# Altium schematic sheet Mainboard_V1.0_MCU.SchDoc: Mainboard
size A4; PageSetup: Record=PageOptions|CenterHorizontal=True|CenterVertical=True|PrintScale=0.97|XCorrection=1.00|YCorrection=1.00|PrintKind=0|BorderSize=5000000|LeftOffset=0|BottomOffset=0|Orientation=2|PaperLength=1000|PaperWidth=1000|Scale=100|PaperSource=7|PrintQuality=-3|MediaType=1|DitherType=10|PrintScaleMode=1|PaperKind=A4|PaperIndex=9; Organization: Ostschweizer Fachhochschule; Address2: Florian Baumgartner & Thierry Schwaller; Address3: florian.baumgartner@ost.ch; DocumentNumber: 2; Revision: V1.0; SheetNumber: 2; SheetTotal: 7; Author: Florian Baumgartner & Alain Keller; Subtitle: MCU
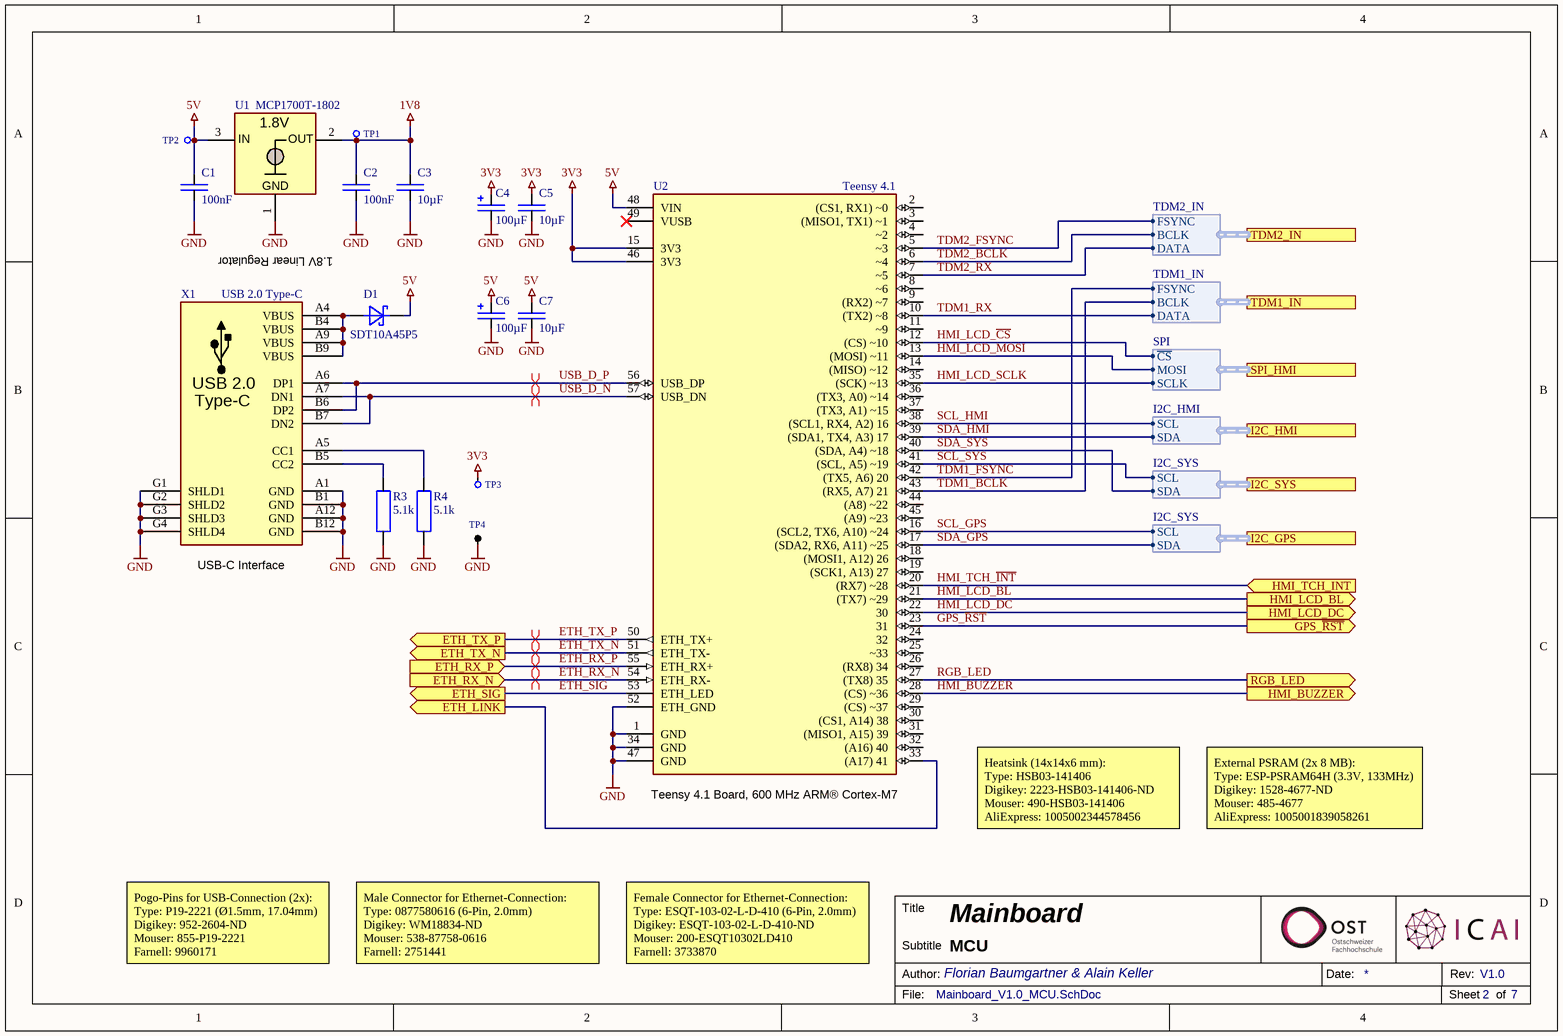
[diagram p0: Mainboard_V1.0_MCU.SchDoc]

## Parts
C1  100nF  [SMD Keramikkondensator 0603]
C2  100nF  [SMD Keramikkondensator 0603]
C3  10µF  [SMD Keramikkondensator 1206]
C4  100µF  [SMD Tantalkondensator 1210 +]
C5  10µF  [SMD Keramikkondensator 1206]
C6  100µF  [SMD Tantalkondensator 1210 +]
C7  10µF  [SMD Keramikkondensator 1206]
D1  SDT10A45P5  [SMD Diode PowerDI-5]
R3  5.1k  [SMD Widerstand 0603]
R4  5.1k  [SMD Widerstand 0603]
TP1  X-TP  [THT Testpunkt Ø1mm]  (value not drawn)  (no BOM)
TP2  X-TP  [THT Testpunkt Ø1mm]  (value not drawn)  (no BOM)
TP3  X-TP  [THT Testpunkt Ø1mm]  (value not drawn)  (no BOM)
TP4  Schwarz  [THT Messpunkt Ø2.54mm Schwarz]  (value not drawn)
U1  MCP1700T-1802  [SMD IC SOT-23-3]
U2  Teensy 4.1  [THT Teensy 4.1]
X1  USB 2.0 Type-C  [THT USB-C Socket (KH-TYPE-C-L10-14P)]

## Ports
ETH_LINK (out), ETH_RX_N (in), ETH_RX_P (in), ETH_SIG (out), ETH_TX_N (out), ETH_TX_P (out), GPS_~{RST} (out), HMI_BUZZER (out), HMI_LCD_BL (out), HMI_LCD_DC (out), HMI_TCH_INT (in), I2C_GPS (harness I2C_SYS), I2C_HMI (harness I2C_HMI), I2C_SYS (harness I2C_SYS), RGB_LED (out), SPI_HMI (harness SPI), TDM1_IN (harness TDM1_IN), TDM2_IN (harness TDM2_IN)

## Harnesses
I2C_HMI: SCL, SDA
TDM1_IN: BCLK, FSYNC, DATA
I2C_SYS: SCL, SDA
TDM2_IN: BCLK, FSYNC, DATA
SPI: SCLK, MOSI, ~{CS}

## Nets
1V8: C2.2 C3.2 TP1.1 U1.2(OUT)
3V3: C4.P(+) C5.2 TP3.1 U2.15(3V3) U2.46(3V3)
5V: C1.2 C6.P(+) C7.2 D1.K TP2.1 U1.3(IN) U2.48(VIN)
GND: C1.1 C2.1 C3.1 C4.M(-) C5.1 C6.M(-) C7.1 R3.2 R4.2 TP4.1 U1.1(GND) U2.1(GND) U2.34(GND) U2.47(GND) U2.52(ETH_GND) X1.A1(GND) X1.A12(GND) X1.B1(GND) X1.B12(GND) X1.G1(SHLD1) X1.G2(SHLD2) X1.G3(SHLD3) X1.G4(SHLD4)
ETH_LINK: U2.33((A17)_41) ; port ETH_LINK
ETH_RX_N: U2.54(ETH_RX-) ; port ETH_RX_N
ETH_RX_P: U2.55(ETH_RX+) ; port ETH_RX_P
ETH_SIG: U2.53(ETH_LED) ; port ETH_SIG
ETH_TX_N: U2.51(ETH_TX-) ; port ETH_TX_N
ETH_TX_P: U2.50(ETH_TX+) ; port ETH_TX_P
GPS_~{RST}: U2.23(31) ; port GPS_~{RST}
HMI_BUZZER: U2.28((CS)_~36) ; port HMI_BUZZER
HMI_LCD_BL: U2.21((TX7)_~29) ; port HMI_LCD_BL
HMI_LCD_~{CS}: U2.12((CS)_~10) ; port SPI_HMI.~{CS}
HMI_LCD_DC: U2.22(30) ; port HMI_LCD_DC
HMI_LCD_MOSI: U2.13((MOSI)_~11) ; port SPI_HMI.MOSI
HMI_LCD_SCLK: U2.35((SCK)_~13) ; port SPI_HMI.SCLK
HMI_TCH_~{INT}: U2.20((RX7)_~28) ; port HMI_TCH_INT
RGB_LED: U2.27((TX8)_35) ; port RGB_LED
SCL_GPS: U2.16((SCL2,_TX6,_A10)_~24) ; port I2C_GPS.SCL
SCL_HMI: U2.38((SCL1,_RX4,_A2)_16) ; port I2C_HMI.SCL
SCL_SYS: U2.41((SCL,_A5)_~19) ; port I2C_SYS.SCL
SDA_GPS: U2.17((SDA2,_RX6,_A11)_~25) ; port I2C_GPS.SDA
SDA_HMI: U2.39((SDA1,_TX4,_A3)_17) ; port I2C_HMI.SDA
SDA_SYS: U2.40((SDA,_A4)_~18) ; port I2C_SYS.SDA
TDM1_BCLK: U2.43((RX5,_A7)_21) ; port TDM1_IN.BCLK
TDM1_FSYNC: U2.42((TX5,_A6)_20) ; port TDM1_IN.FSYNC
TDM1_RX: U2.10(NC) ; port TDM1_IN.DATA
TDM2_BCLK: U2.6(~4) ; port TDM2_IN.BCLK
TDM2_FSYNC: U2.5(~3) ; port TDM2_IN.FSYNC
TDM2_RX: U2.7(~5) ; port TDM2_IN.DATA
USB_D_N: U2.57(USB_DN) X1.A7(DN1) X1.B7(DN2)
USB_D_P: U2.56(USB_DP) X1.A6(DP1) X1.B6(DP2)
NetD1_A: D1.A X1.A4(VBUS) X1.A9(VBUS) X1.B4(VBUS) X1.B9(VBUS)
NetR3_1: R3.1 X1.B5(CC2)
NetR4_1: R4.1 X1.A5(CC1)

Not connected (* = marked no-connect by the designer): U2 2((CS1,_RX1)_~0) 3((MISO1,_TX1)_~1) 4(~2) 8(~6) 9(NC) 11(NC) 14((MISO)_~12) 18((MOSI1,_A12)_26) 19((SCK1,_A13)_27) 24(32) 25(~33) 26((RX8)_34) 29((CS)_~37) 30((CS1,_A14)_38) 31((MISO1,_A15)_39) 32((A16)_40) 36((TX3,_A0)_~14) 37((TX3,_A1)_~15) 44((A8)_~22) 45((A9)_~23) 49(VUSB)*

## Layout directives
differential pair: ETH_RX_N, ETH_RX_P, ETH_TX_N, ETH_TX_P, USB_D_N, USB_D_P

## Notes on the sheet
- 1.8V Linear Regulator
- (near X1) USB-C Interface
- (near U2) Teensy 4.1 Board, 600 MHz ARM® Cortex-M7
- Heatsink (14x14x6 mm):
  Type: HSB03-141406
  Digikey: 2223-HSB03-141406-ND
  Mouser: 490-HSB03-141406
  AliExpress: 1005002344578456
- External PSRAM (2x 8 MB):
  Type: ESP-PSRAM64H (3.3V, 133MHz)
  Digikey: 1528-4677-ND
  Mouser: 485-4677
  AliExpress: 1005001839058261
- Pogo-Pins for USB-Connection (2x):
  Type: P19-2221 (Ø1.5mm, 17.04mm)
  Digikey: 952-2604-ND
  Mouser: 855-P19-2221
  Farnell: 9960171
- Male Connector for Ethernet-Connection:
  Type: 0877580616 (6-Pin, 2.0mm)
  Digikey: WM18834-ND
  Mouser: 538-87758-0616
  Farnell: 2751441
- Female Connector for Ethernet-Connection:
  Type: ESQT-103-02-L-D-410 (6-Pin, 2.0mm)
  Digikey: ESQT-103-02-L-D-410-ND
  Mouser: 200-ESQT10302LD410
  Farnell: 3733870
- Title
- Author:
- Subtitle
- Date:
- Rev:
- File:
- Sheet
- of
- (in symbol T-MCP1700T-1.8) 1.8V
- (in symbol X-USB-Buchse_Vertical) USB 2.0

## Library data of the parts
C1 C2 = E6 - 100nF: SMD Ceramic Capacitor E6; Component Value: 100nF 50V; Component Description: Multilayer Ceramic Capacitors MLCC; ComponentLink1Description: Datasheet; ComponentLink1URL: https://datasheet.lcsc.com/lcsc/1809301912_YAGEO-CC0603KRX7R9BB104_C14663.pdf; Digikey: 445-6899-1-ND; Farnell: 2210822; JLC-Parts: C14663; Mouser: 810-CGA2B3X7R1H104K; Unit Price: 0.01
C3 C5 C7 = E6 - 10uF: SMD Ceramic Capacitor E6; Component Value: 10µF 50V; Component Description: Multilayer Ceramic Capacitors MLCC; ComponentLink1Description: Datasheet; ComponentLink1URL: https://datasheet.lcsc.com/lcsc/1810191219_Samsung-Electro-Mechanics-CL10A106KP8NNNC_C19702.pdf; Digikey: 587-3258-1-ND; Farnell: 2113070; JLC-Parts: C13585; Mouser: 963-LMK107BBJ106MALT; Unit Price: 0.01
C4 C6 = C-ELCAP: CAP-Elko; Component Description: Tantalum Capacitor; Component Value: 100µF 6.3V; Digikey: 478-1677-1-ND; Farnell: 1135048; Mouser: 581-TAJB107K006R; JLC-Parts: C16133; Unit Price: 0.08
D1 = R-DIODE:SCHKY: Trench Schottky Barrier Rectifier; Component Value: SDT10A45P5-13; Mouser: 621-SDT10A45P5-13; Farnell: 3944970; Digikey: 31-SDT10A45P5-13CT-ND; JLC-Parts: C2997843; Component Description: Trench Schottky Barrier Rectifier; Unit Price: 0.19; ComponentLink1Description: Datasheet; ComponentLink1URL: https://www.diodes.com/assets/Datasheets/SDT10A45P5.pdf
R3 R4 = R-RESISTOR: RES (E=Heizwiderstand B=Messwandler); Component Description: Thick Film Chip Resistor; Component Value: 5.1k (75V, 100mW, 1%); Digikey: P5.10KHCT-ND; Farnell: 2059378; Mouser: 667-ERJ-3EKF5101V; JLC-Parts: C23186; Unit Price: 0.01
TP1-TP3 = X-TP: Testpunkt; Component Value: Ø 0.8mm; Component Description: Testpunkt; Unit Price: 0.00
TP4 = X-MP: Messpunkt; Component Description: Ground-Clip; Component Value: Ø 2.54mm (Black); Digikey: 36-5001-ND; Farnell: 2301278; Mouser: 534-5001; JLC-Parts: C238122; Unit Price: 0.36
U1 = T-MCP1700T-1.8: Voltage Regulator; Component Description: Linear Voltage Regulator; Component Value: MCP1700T-1802E (1.8V, 200mA); Digikey: MCP1700T1802ETTCT-ND; Farnell: 1296591; Mouser: 579-MCP1700T1802E/TT; ComponentLink1Description: Datasheet; ComponentLink1URL: https://datasheet.lcsc.com/lcsc/2304140030_Microchip-Tech-MCP1700T-1802E-TT_C150796.pdf; JLC-Parts: C150796; Unit Price: 0.37
U2 = U-Teensy-4.1: RT1062 i.MX ARM® Cortex®-M7 MPU; ComponentLink1Description: Datasheet; ComponentLink1URL: https://mm.digikey.com/Volume0/opasdata/d220001/medias/docus/497/DEV-16771_Web.pdf; Digikey: 1568-DEV-16771-ND; Component Value: Teensy 4.1; Mouser: 474-DEV-16771; Unit Price: 28.70; Component Description: RT1062 i.MX ARM® Cortex®-M7 MPU
X1 = X-USB-Buchse_Vertical: Type-C; aliExpress: 1005003021508194; Component Description: USB Connector Type-C Vertical; Component Value: KH-TYPE-C-L10-14P; ComponentLink1Description: Datasheet; ComponentLink1URL: https://datasheet.lcsc.com/lcsc/2103161911_Shenzhen-Kinghelm-Elec-KH-TYPE-C-L10-14P_C2761226.pdf; JLC-Parts: C2761226; Unit Price: 0.27